# EAGLE schematic Transformerless Power Supply (EAGLE 6.2)
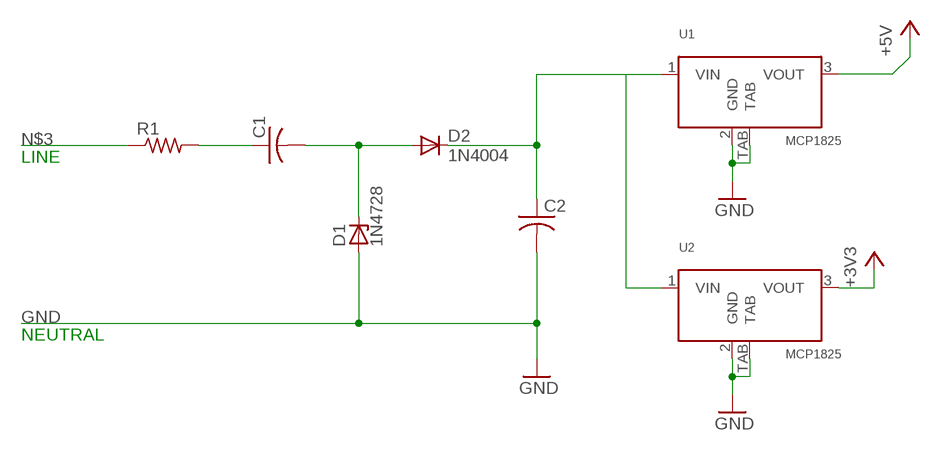
[diagram p0: schematic, sheet 1]

## Parts
C1  C-US025-024X044  [C025-024X044]
C2  C-US025-024X044  [C025-024X044]
D1  1N4728  [DO41Z10]
D2  1N4004  [DO41-10]
R1  R-US_0204/2V  [0204V]
U1  MCP1825  [SOT223_MICROCHIP]
U2  MCP1825  [SOT223_MICROCHIP]

## Nets
+5V: U1.3(VOUT)
GND: C2.2 D1.A U1.2(GND) U1.TAB U2.2(GND) U2.TAB
LINE: C2.1 D2.C R1.1 U1.1(VIN) U2.1(VIN)
N$3: C1.2 D1.C D2.A
N$5: C1.1 R1.2
NEUTRAL: U2.3(VOUT) ; supply symbol labelled +3V3

## Notes on the sheet
- LINE
- NEUTRAL

## Library data of the parts
C1 C2 = resistor:C-US: CAPACITOR, American symbol
D1 = diode:1N4728: Z DIODE 3.3 V, 1W, 5 percent
D2 = diode:1N4004: DIODE general purpose rectifier, 1 A
R1 = resistor:R-US_: RESISTOR, American symbol
U1 U2 = Cool_Electricity:MCP1825: MCP1825 LDO Voltage regulator by microchip